# Altium schematic sheet 5V-3.3V.SchDoc
size A4
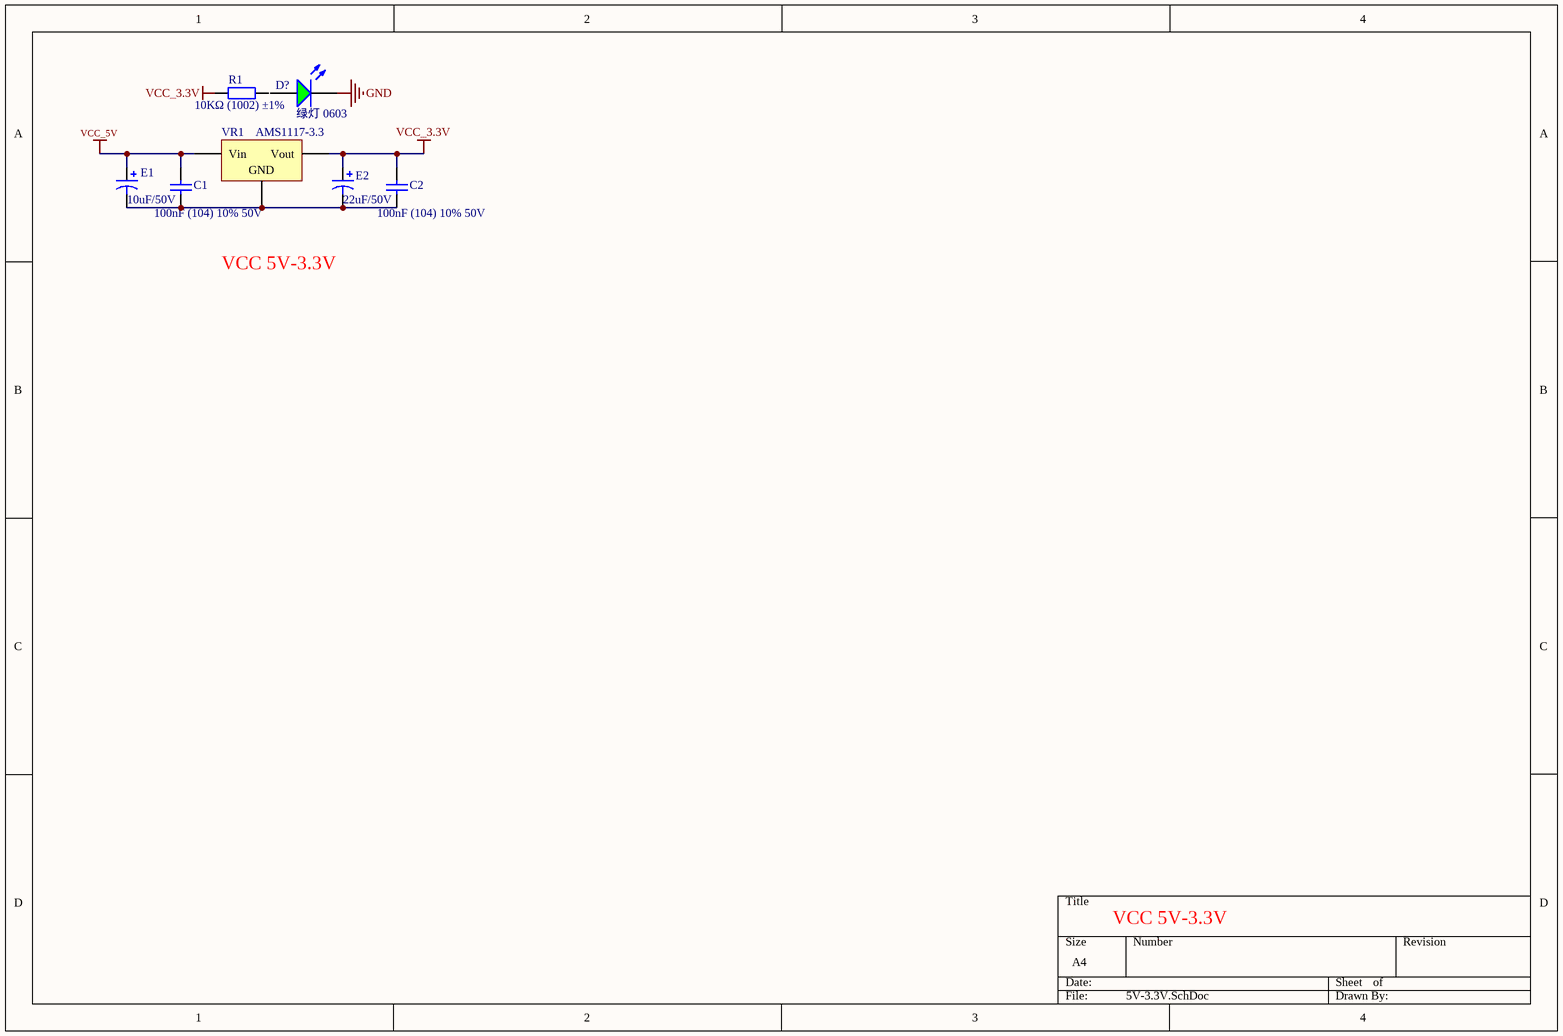
[diagram p0: 5V-3.3V.SchDoc]

## Parts
C1  100nF (104) 10% 50V  [CAPC_0603_2]
C2  100nF (104) 10% 50V  [CAPC_0603_2]
D?  绿灯 0603  [LED_0603_G]
E1  value 10uF/50V  [CAP_PR_2.0_5]  (hidden comment: Cap Pol1)
E2  value 22uF/50V  [CAP_PR_2.0_5]  (hidden comment: Cap Pol1)
R1  10KΩ (1002) ±1%  [RESC_0603_2]
VR1  AMS1117-3.3  [SOT223_3]

## Nets
GND: D?.K
VCC_3.3V: C2.2 E2.1 VR1.2(Vout)
VCC_5V: C1.2 E1.1 VR1.3(Vin)
NetC1_1: C1.1 C2.1 E1.2 E2.2 VR1.1(GND)

Not connected (* = marked no-connect by the designer): D? A; R1 1 2

## Notes on the sheet
- VCC 5V-3.3V
- Labels drawn without touching a wire or pin: VCC_3.3V

## Library data of the parts
C1 C2 = 0603 100nF (104) 10% 50V: 贴片电容; ComponentLink1Description: 供应商链接; ComponentLink1URL: http://www.szlcsc.com/product/details_15331.html; Package: 0603; Supplier: LC; SuppliersPartNumber: C14663
D? = 0603 绿灯: 发光二极管; ComponentLink1Description: 供应商链接; ComponentLink1URL: http://www.szlcsc.com/product/details_73152.html; Package: 0603; Supplier: LC; SuppliersPartNumber: C72043
E1 E2 = Cap Pol1: Polarized Capacitor (Radial); Published: 8-Jun-2000; LatestRevisionDate: 17-Jul-2002; LatestRevisionNote: Re-released for DXP Platform.; PackageReference: RB7.6-15; Publisher: Altium Limited
R1 = 0603 10KΩ (1002) 1%: 贴片电阻; ComponentLink1Description: 供应商链接; ComponentLink1URL: http://www.szlcsc.com/product/details_26547.html; Package: 0603; Supplier: LC; SuppliersPartNumber: C25804
VR1 = SOT-223 AMS1117-3.3: 低压差线性稳压(LDO); ComponentLink1Description: 供应商链接; ComponentLink1URL: http://www.szlcsc.com/product/details_6652.html; Package: SOT-223; Supplier: LC; SuppliersPartNumber: C6186